# EAGLE design untitled (EAGLE 9.6.2)
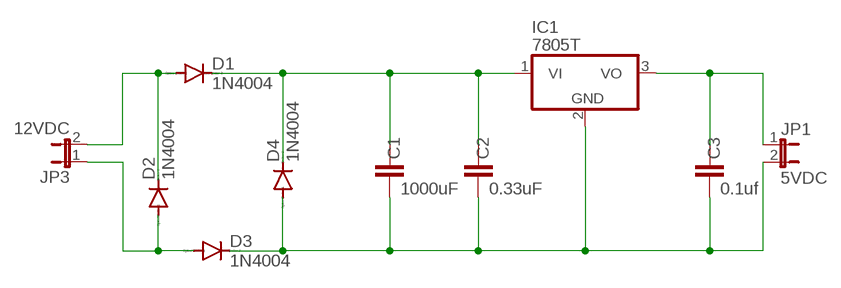
[diagram p0: schematic, sheet 1]

## Parts
C1  1000uF  C2,5-3  [C2.5-3]
C2  0.33uF  C2,5-3  [C2.5-3]
C3  0.1uf  C2,5-3  [C2.5-3]
D1  1N4004  [DO41-10]
D2  1N4004  [DO41-10]
D3  1N4004  [DO41-10]
D4  1N4004  [DO41-10]
IC1  7805T  [TO220H]
JP1  5VDC  JP1E  [JP1]
JP3  12VDC  JP1E  [JP1]

## Nets
N$1: D1.A D2.C JP3.2
N$2: C1.1 C2.1 D1.C D4.C IC1.1(VI)
N$3: C1.2 C2.2 C3.2 D3.C D4.A IC1.2(GND) JP1.2
N$4: D2.A D3.A JP3.1
N$7: C3.1 IC1.3(VO) JP1.1

## Library data of the parts
C1-C3 = capacitor-wima:C: CAPACITOR naming: grid - package width
D1-D4 = diode:1N4004: DIODE general purpose rectifier, 1 A
IC1 = linear:78*: Positive VOLTAGE REGULATOR Source: http://cache.national.com/ds/LM/LM78L05.pdf http://www.fairchildsemi.com/ds/LM/LM7805.pdf
JP1 JP3 = jumper:JP1E: JUMPER

## Board
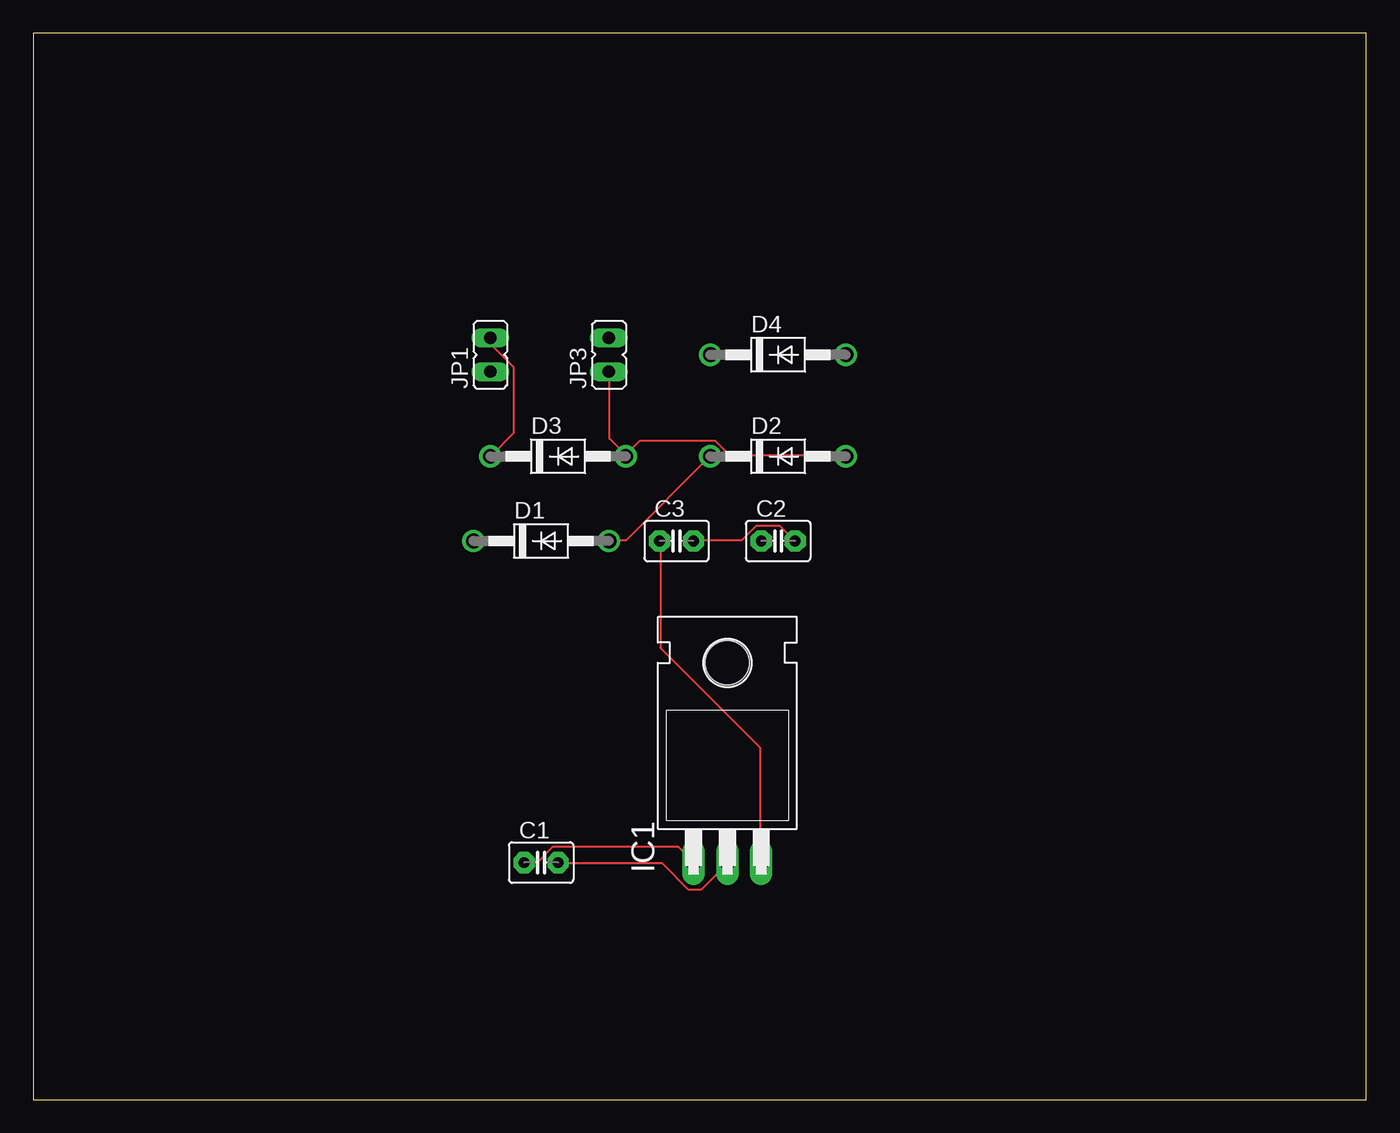
[diagram p1: board, top side]
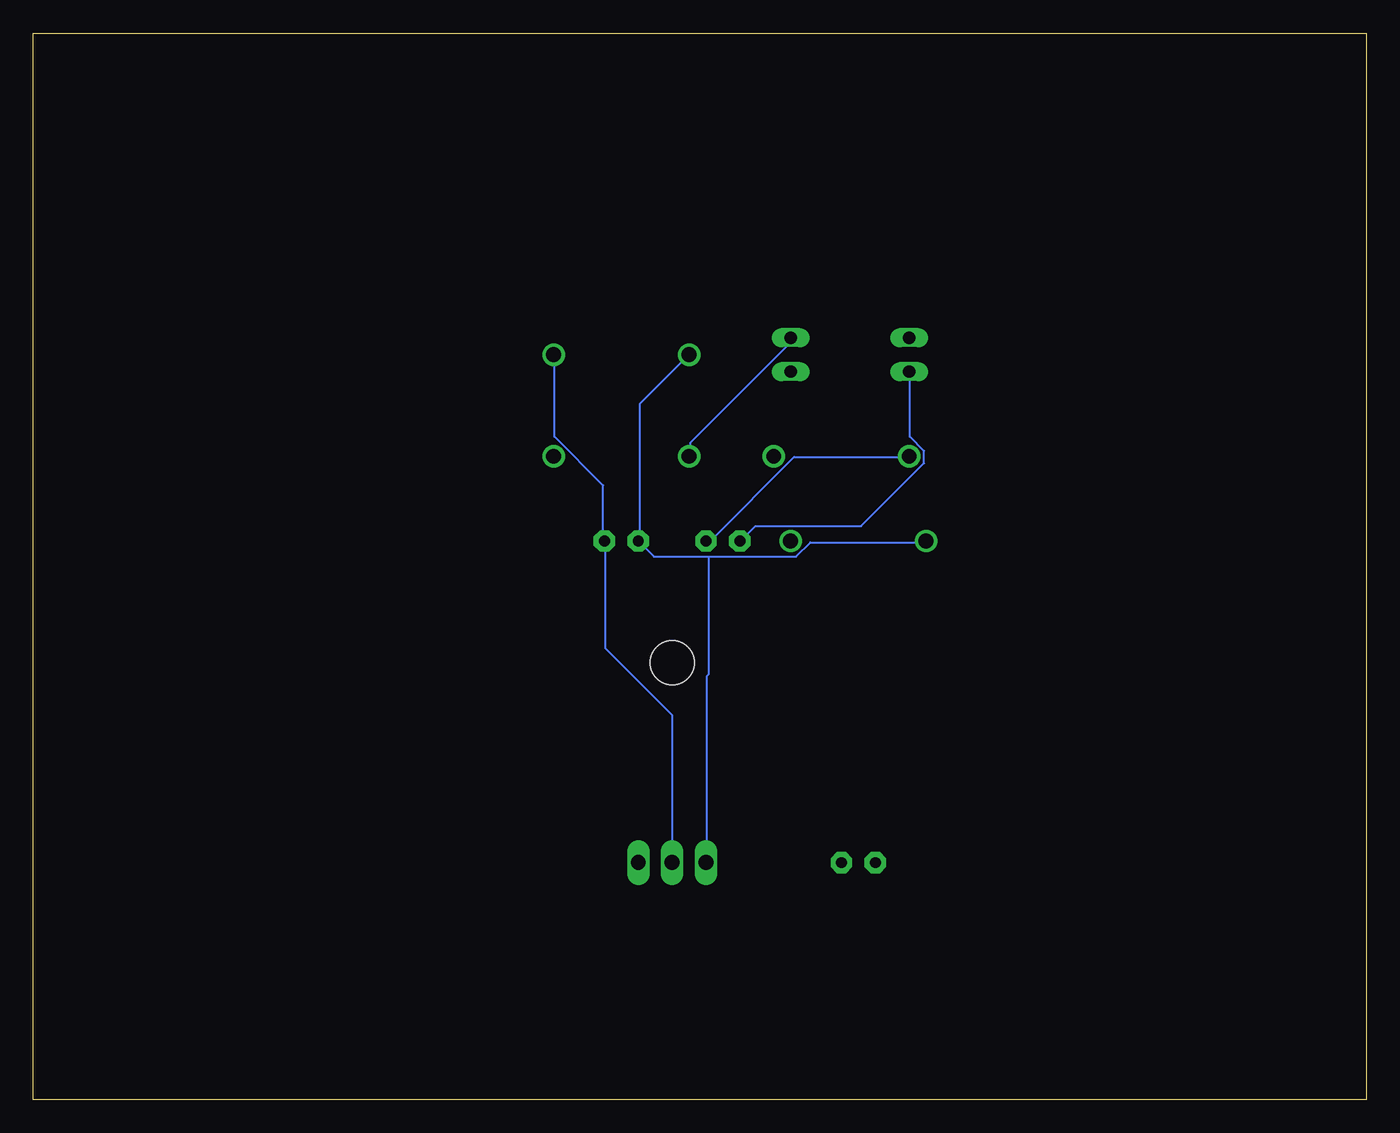
[diagram p2: board, bottom side, seen from below]

Size 100 x 80 mm. Coordinates in mm from the lower left corner, seen from the top.
Outline: 0,0 100,0 100,80 0,80 0,0
Copper layers (1*16): Top 0.035mm / dielectric 1.5mm / Bottom 0.035mm
Design rules "default": minimum track width 6mil, minimum drill 0.35mm, track to track 6mil, track to pad 6mil, pad to pad 6mil, via to via 6mil, smd to smd 6mil, copper to edge 40mil, drill to drill 6mil, minimum pad ring 10mil, minimum via ring 8mil, stop-mask expansion 4mil, vias tented up to drill 0mil, thermal gap 10mil

### Footprints (pad centres in the part's own frame; a part is rotated, then mirrored left to right if it is on the bottom)
C2.5-3 = drill 0.813 pad 1.6 octagon: 1 -1.27,0; 2 1.27,0
DO41-10 = drill 1.118: A 5.08,0; C -5.08,0
TO220H = drill 1.118 long: 1 -2.54,-10.16; 2 0,-10.16; 3 2.54,-10.16 | hole 3.302: 0,4.826
JP1 = drill 0.914 long: 1 0,-1.27; 2 0,1.27

### Placement (x,y rotation side)
C1  38.1,17.78 0 top
C2  55.88,41.91 0 top
C3  48.26,41.91 0 top
D1  38.1,41.91 0 top
D2  55.88,48.26 0 top
D3  39.37,48.26 0 top
D4  55.88,55.88 0 top
IC1  52.07,27.94 0 top
JP1  34.29,55.88 0 top
JP3  43.18,55.88 0 top

### Tracks (layer width: path | path; a pad name or v marks a point on that pad's centre or on a via)
N$1
  Top 0.152: D1.A 43.23,41.96 44.45,41.96 50.7,48.21 D2.C
  Bottom 0.152: JP3.2 43.23,57.05 43.23,56.74 50.7,49.28 50.7,48.36 D2.C
N$2
  Top 0.152: C1.1 36.83,17.88 37.9,17.88 38.96,18.95 48.41,18.95 49.48,17.88 IC1.1
  Bottom 0.152: D4.C 54.51,52.17 54.51,41.96 C2.1 53.44,40.74 49.33,40.74 | 49.33,40.74 42.77,40.74 41.71,41.81 33.02,41.81 D1.C | 49.33,40.74 49.33,31.9 49.48,31.75 49.48,17.88 IC1.1
N$3
  Top 0.152: C1.2 39.42,17.73 47.19,17.73 49.17,15.75 50.09,15.75 52.07,17.73 IC1.2 | D3.C 36.07,50.04 36.07,54.91 34.39,56.59 34.39,57.05 JP1.2 | C2.2 56.03,43.03 54.2,43.03 53.14,41.96 49.63,41.96 C3.2
  Bottom 0.152: D4.A 60.91,55.83 60.91,49.73 57.25,46.08 57.25,41.96 C2.2 57.1,41.81 57.1,33.88 52.07,28.85 IC1.2 | D3.C 34.39,48.21 42.93,48.21 49.17,41.96 49.48,41.96 C3.2
N$4
  Top 0.152: 44.45,48.36 43.23,49.58 43.23,54.61 JP3.1 | 44.45,48.36 45.52,49.43 51.16,49.43 52.22,48.36 60.91,48.36 D2.A | 44.45,48.36 D3.A
N$7
  Top 0.152: IC1.3 54.51,17.88 54.51,26.42 47.04,33.88 47.04,41.81 C3.1
  Bottom 0.152: JP1.1 34.24,54.61 34.24,49.73 33.17,48.67 33.17,47.75 37.9,43.03 45.82,43.03 46.89,41.96 C3.1